# EAGLE design tras (EAGLE 9.6.2)
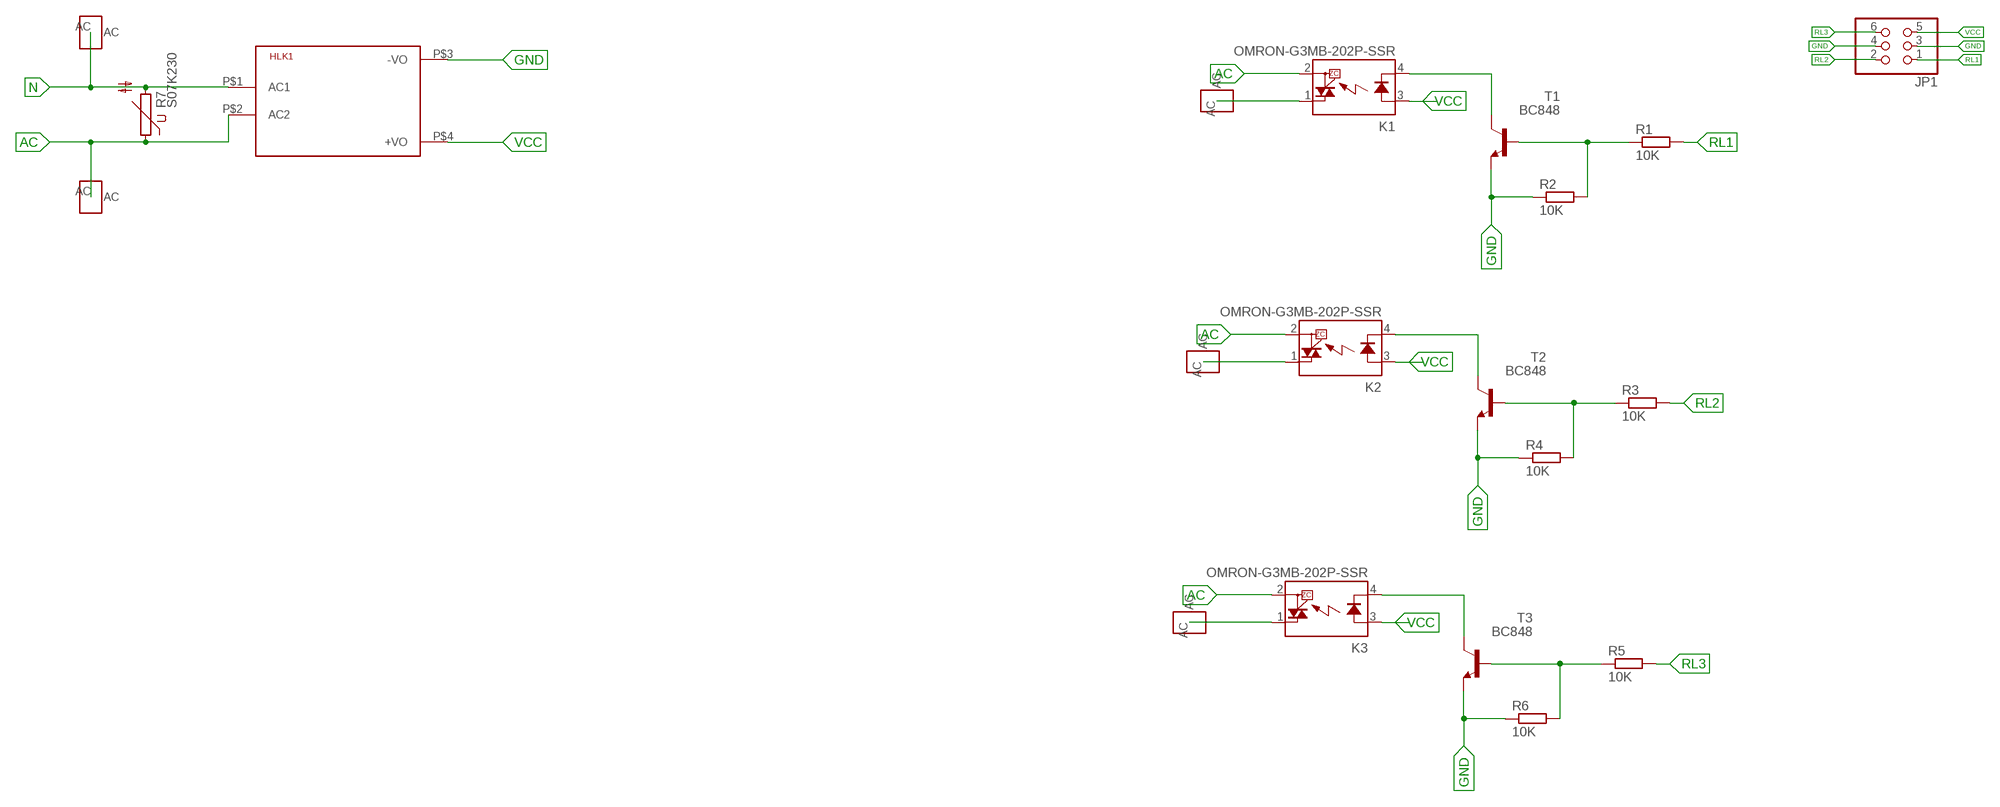
[diagram p0: schematic, sheet 1]

## Parts
AC  PAN_AC  [PAD_AC]
HLK1  HLK-PM013W  [HLK-PM01]
JP1  PINHD-2X3M  [2X03M]
K1  OMRON-G3MB-202P-SSR  [OMRON-G3MB-202P-SSR]
K2  OMRON-G3MB-202P-SSR  [OMRON-G3MB-202P-SSR]
K3  OMRON-G3MB-202P-SSR  [OMRON-G3MB-202P-SSR]
L1  PAN_AC  [PAD_AC]
L2  PAN_AC  [PAD_AC]
L3  PAN_AC  [PAD_AC]
N  PAN_AC  [PAD_AC]
R1  10K  R-EU_R0805  [R0805]
R2  10K  R-EU_R0805  [R0805]
R3  10K  R-EU_R0805  [R0805]
R4  10K  R-EU_R0805  [R0805]
R5  10K  R-EU_R0805  [R0805]
R6  10K  R-EU_R0805  [R0805]
R7  S07K230  [S07K230]
T1  BC848  [SOT23]
T2  BC848  [SOT23]
T3  BC848  [SOT23]

## Nets
AC [220v]: AC.AC HLK1.P$2(AC2) K1.2(DS2) K2.2(DS2) K3.2(DS2) R7.1
GND: HLK1.P$3(-VO) JP1.3 JP1.4 R2.1 R4.1 R6.1 T1.2(E) T2.2(E) T3.2(E)
L1 [220v]: K1.1(DS1) L1.AC
L2 [220v]: K2.1(DS1) L2.AC
L3 [220v]: K3.1(DS1) L3.AC
N [220v]: HLK1.P$1(AC1) N.AC R7.2
N$2: K1.4(K) T1.3(C)
N$3: R1.1 R2.2 T1.1(B)
N$7: K2.4(K) T2.3(C)
N$8: R3.1 R4.2 T2.1(B)
N$12: K3.4(K) T3.3(C)
N$13: R5.1 R6.2 T3.1(B)
RL1: JP1.1 R1.2
RL2: JP1.2 R3.2
RL3: JP1.6 R5.2
VCC: HLK1.P$4(+VO) JP1.5 K1.3(A) K2.3(A) K3.3(A)

## Library data of the parts
AC L1-L3 N = pin_ac:PAN_AC
HLK1 = HLK-PM01:HLK-PM01: Hi-Link Power Supply HLK-PM01 3W Author: Ahmed Said <https://github.com/AhmedSaid/EAGLELibraries>
JP1 = pinhead:PINHD-2X3: PIN HEADER
K1-K3 = Omron G3MB 202p SSR:OMRON-G3MB-202P-SSR: IT(rms) 8A, Zero Cross type SIP 4pin Triac output SSR Source: http://sharp-world.com/products/device/lineup/data/pdf/datasheet/s102s02_e.pdf
R1-R6 = rcl:R-EU_: RESISTOR, European symbol; SPICEPREFIX: R
R7 = varistor:S07K230: VARISTOR
T1-T3 = transistor:BC848: NPN TRANSISTOR

## Net classes
0 default: width 0.051 mm
1 220v: width 1.27 mm

## Board
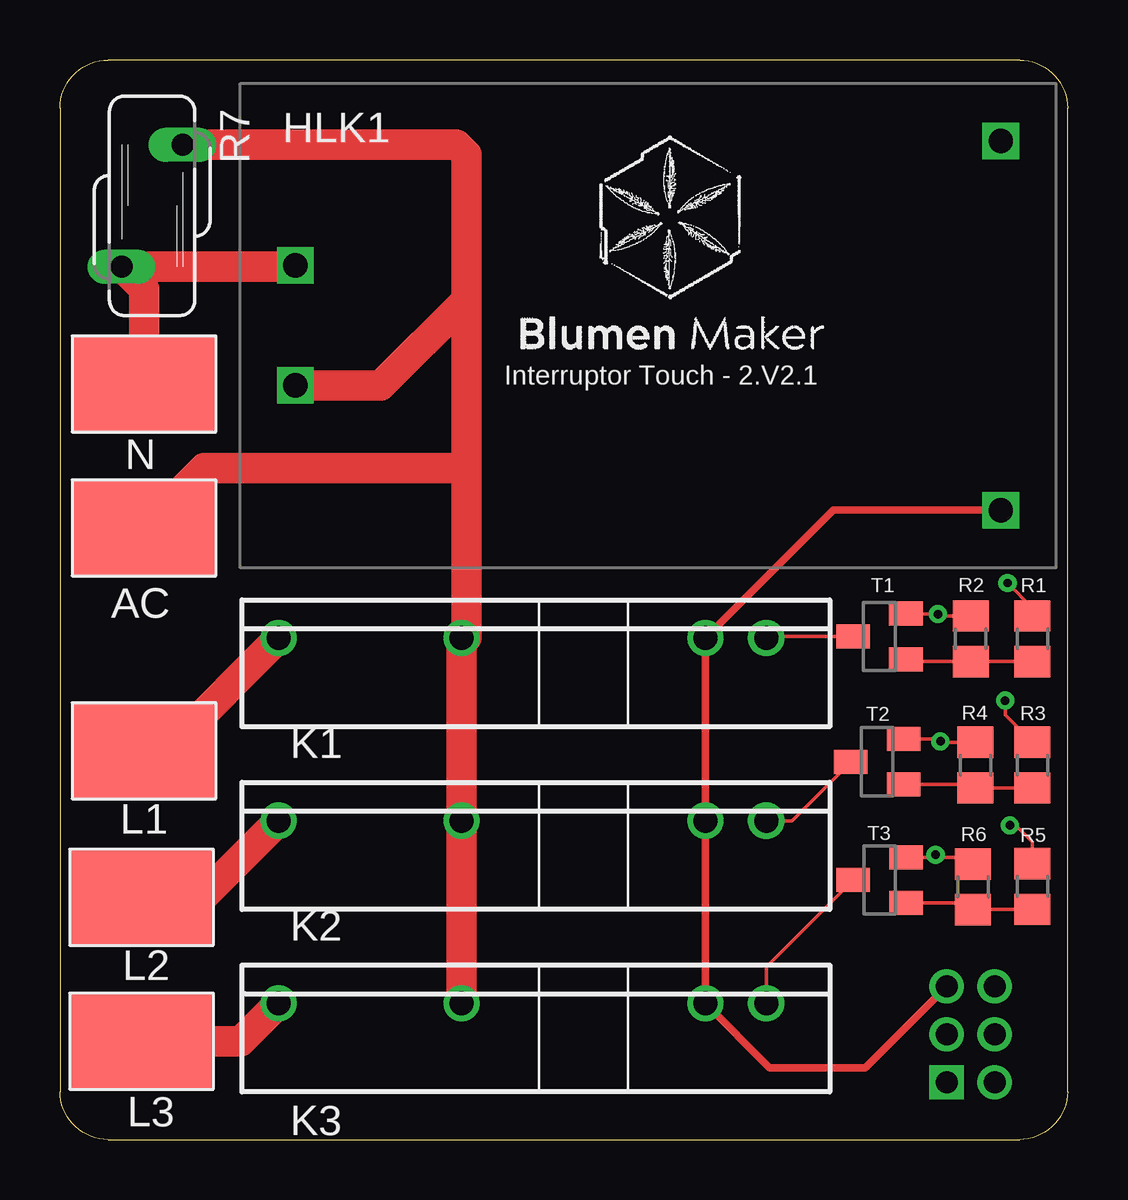
[diagram p1: board, top side]
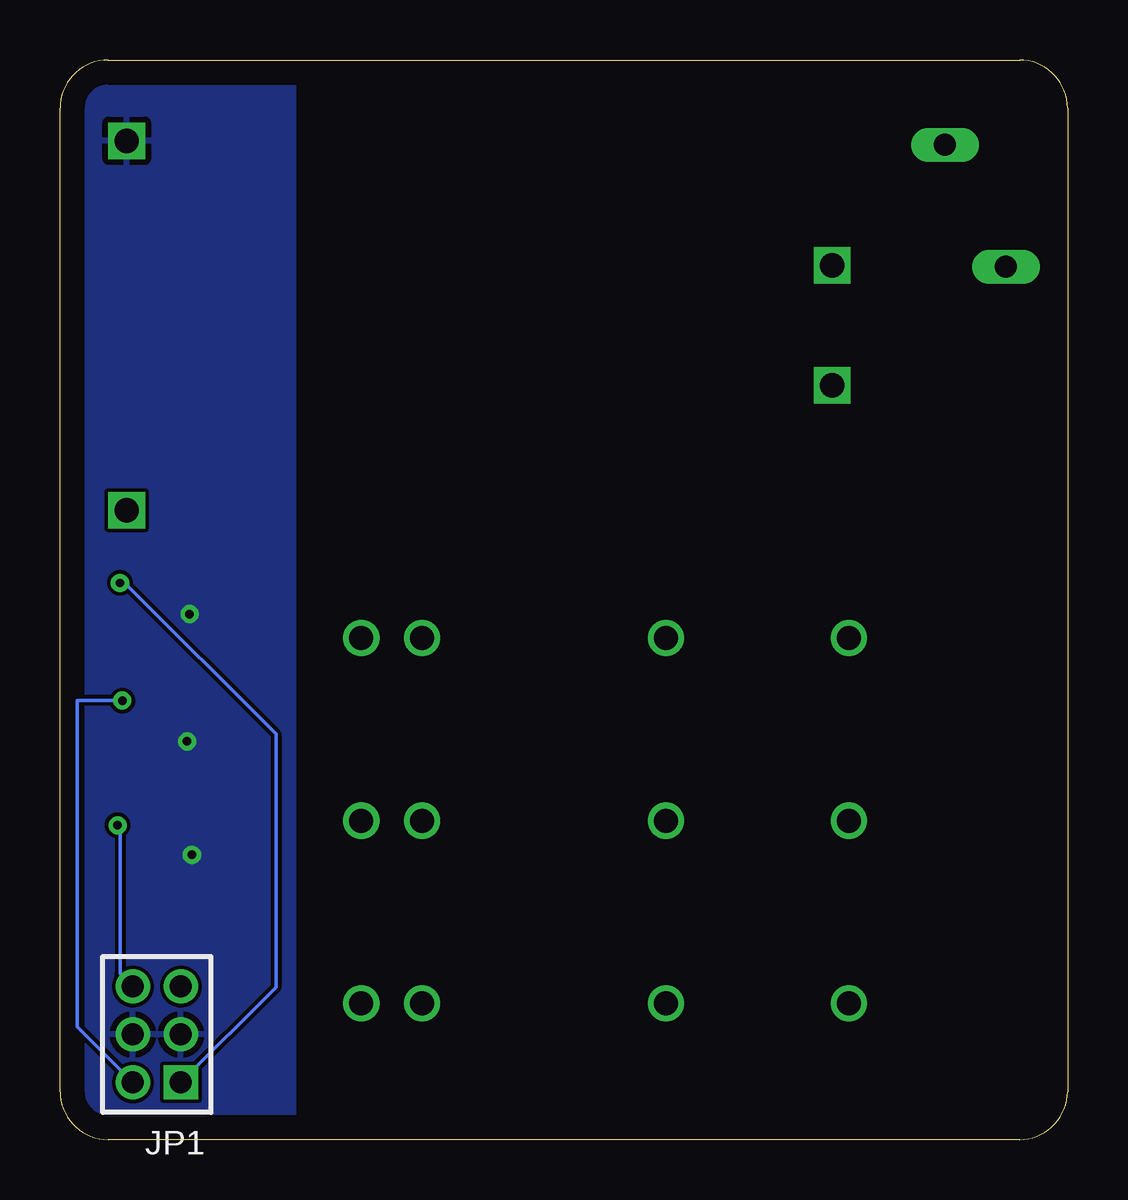
[diagram p2: board, bottom side, seen from below]

Size 42 x 45 mm. Coordinates in mm from the lower left corner, seen from the top.
Outline: 2,0 40,0 arc90 42,2 42,43 arc90 40,45 2,45 arc90 0,43 0,2 arc90 2,0
Copper layers (1*16): Top 0.035mm / dielectric 1.5mm / Bottom 0.035mm
Design rules "default": minimum track width 6mil, minimum drill 0.35mm, track to track 6mil, track to pad 6mil, pad to pad 6mil, via to via 6mil, smd to smd 6mil, copper to edge 40mil, drill to drill 6mil, minimum pad ring 10mil, minimum via ring 8mil, stop-mask expansion 4mil, vias tented up to drill 0mil, thermal gap 10mil

### Footprints (pad centres in the part's own frame; a part is rotated, then mirrored left to right if it is on the bottom)
PAD_AC = smd 4 x 6: AC 0,0
HLK-PM01 = drill 1.016 square: P$1 -14.7,2.5; P$2 -14.7,-2.5; P$3 14.7,7.7; P$4 14.7,-7.7
2X03M = drill 0.914 square: 1 -2,-1 | drill 0.914: 2 -2,1; 3 0,-1; 4 0,1; 5 2,-1; 6 2,1
OMRON-G3MB-202P-SSR = drill 1: 1 1.64,3.8; 2 9.26,3.8; 3 19.42,3.8; 4 21.96,3.8
R0805 = smd 1.3 x 1.5: 1 -0.95,0; 2 0.95,0
S07K230 = drill 0.914 long: 1 -1.27,-2.54; 2 1.27,2.54
SOT23 = smd 1 x 1.4: 1 -0.95,-1.1; 2 0.95,-1.1; 3 0,1.1

### Placement (x,y rotation side)
AC  3.5,25.5 90 top
HLK1  24.52,33.93 0 top
JP1  37.96,4.38 90 bottom
K1  7.48,17.1 0 top
K2  7.48,9.49 0 top
K3  7.48,1.88 0 top
L1  3.5,16.2 90 top
L2  3.4,10.1 90 top
L3  3.4,4.1 90 top
N  3.5,31.5 90 top
R1  40.54,20.87 90 top
R2  37.96,20.87 270 top
R3  40.54,15.61 90 top
R4  38.16,15.61 270 top
R5  40.54,10.55 90 top
R6  38.06,10.53 270 top
R7  3.84,38.92 180 top
T1  34.16,20.97 90 top
T2  34.06,15.75 90 top
T3  34.17,10.82 90 top

### Tracks (layer width: path | path; a pad name or v marks a point on that pad's centre or on a via)
AC
  Top 1.27: R7.1 16.54,41.46 16.94,41.06 16.94,35 | 16.94,35 16.94,28 | 16.94,28 16.94,20.94 K1.2 K2.2 K3.2 | HLK1.P$2 13.37,31.43 16.94,35 | AC.AC 6,28 16.94,28
GND  (via drill 0.35)
  Top 0.152: T3.2 36.4,11.77 v36.5,11.87 36.6,11.77 37.77,11.77 | 38.16,16.8 R4.1 36.8,16.56 36.8,16.6 v36.7,16.6 36.7,16.7 T2.2 35.16,16.8 | R2.1 36.6,21.82 v36.6,21.9 35.26,21.9 T1.2
  Top 0.406: 37.77,11.77 R6.1 | 37.59,22 R2.1
  pour Bottom: 34.5,0 42,0 42,2.9 42,45 32.2,45 32.2,0
L1
  Top 1.27: L1.AC 3.8,16.5 4,16.5 | 4,16.5 4.85,17.35 | K1.1 4.72,16.5 4,16.5
L2
  Top 1.27: 4.32,10.1 L2.AC 4.42,9.98 4.42,10 | K2.1 5.83,10 4.42,10 | 4.42,10 3,10
L3
  Top 1.27: K3.1 7.54,4.1 L3.AC
N
  Top 1.27: HLK1.P$1 9.77,36.38 R7.2 3.5,35.45 N.AC
N$2
  Top 0.152: K1.4 29.51,20.97 T1.3
N$3
  Top 0.152: R1.1 R2.2 35.36,19.92
  Top 0.406: R1.1 40.31,20.15 | T1.1 35.36,19.92
N$7
  Top 0.152: T2.3 30.5,13.29 K2.4
N$8
  Top 0.152: T2.1 38.02,14.8 R4.2 R3.1
N$12
  Top 0.152: T3.3 29.44,7.19 K3.4
N$13
  Top 0.152: R6.2 37.77,9.87 T3.1 | R5.1 38.08,9.6
  Top 0.406: 38.08,9.6 R6.2
RL1  (via drill 0.35)
  Top 0.152: v39.5,23.2 40.54,22.16 R1.2
  Top 0.406: R1.2 40.5,21.86
  Bottom 0.152: v39.5,23.2 39.3,23.2 33,16.9 33,6.34 JP1.1
RL2  (via drill 0.35)
  Top 0.152: R3.2 39.4,17.7 v39.4,18.3
  Bottom 0.152: v39.4,18.3 41.28,18.3 41.28,4.7 JP1.2
RL3  (via drill 0.35)
  Top 0.152: v39.6,13.1 39.84,13.1 40.54,12.4 R5.2
  Bottom 0.152: v39.6,13.1 39.6,13 39.5,12.9 39.5,6.92 JP1.6
VCC
  Top 0.305: HLK1.P$4 32.23,26.23 K1.3 K2.3 K3.3 29.58,3 33.58,3 JP1.5

### Text on the board
_tNames: Interruptor Touch - 2.V2.1
200bmp: C:/Users/User/Desktop/logo2.bmp